# Altium schematic sheet BatteryCharger.SchDoc
size A4
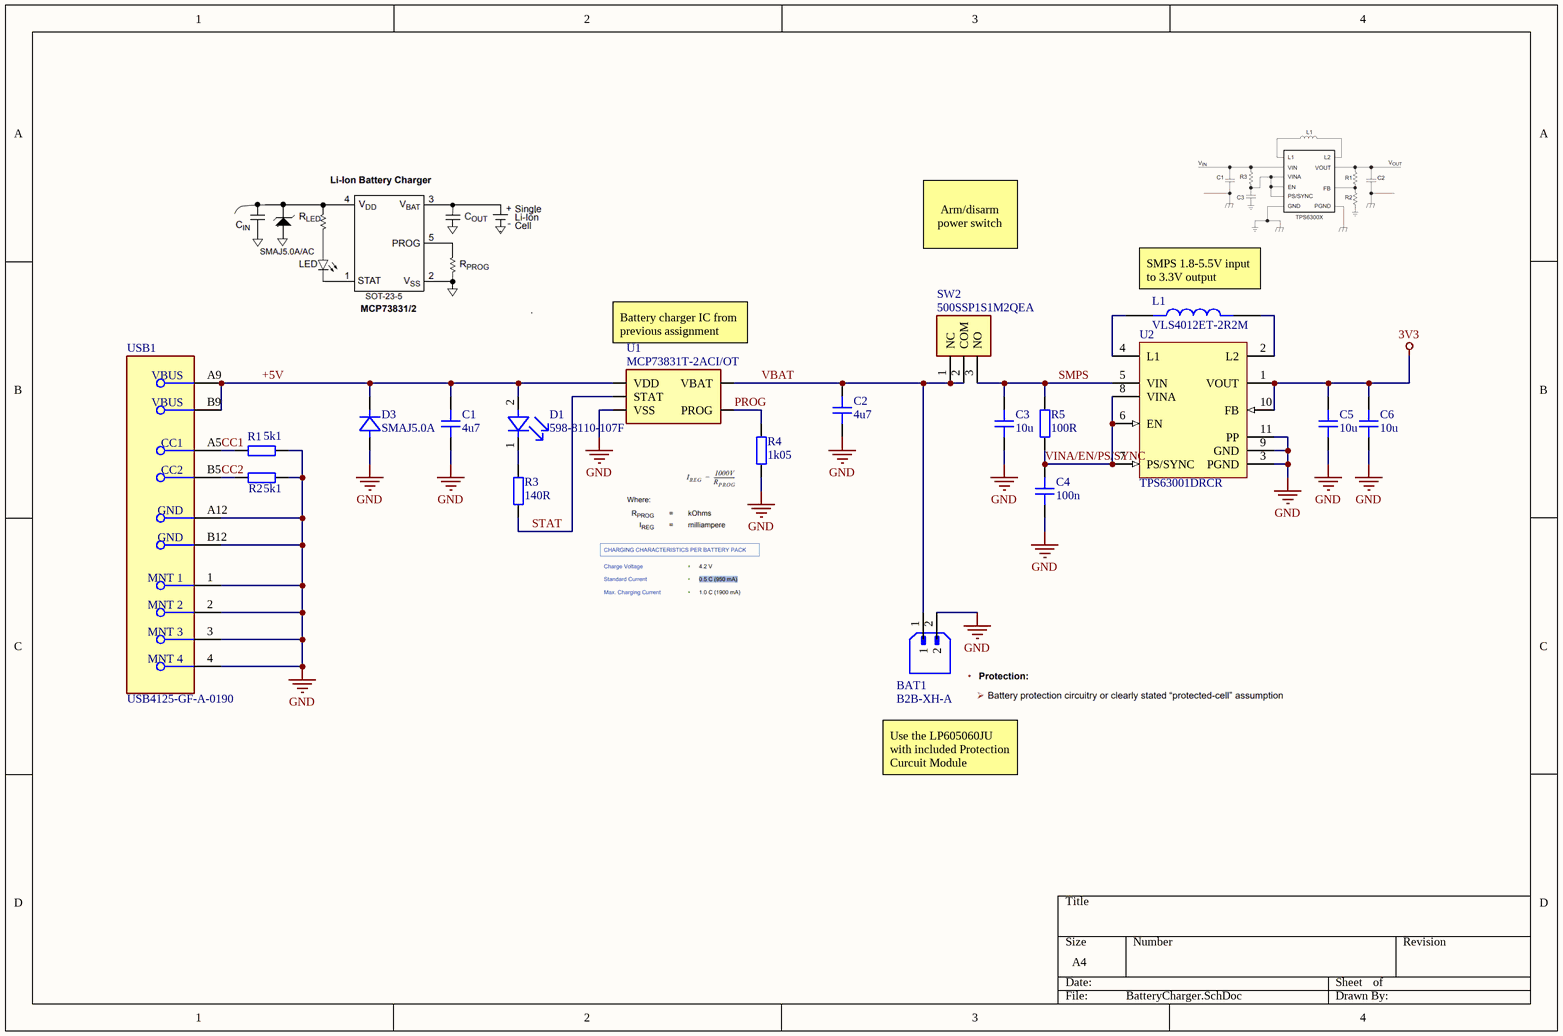
[diagram p0: BatteryCharger.SchDoc]

## Parts
BAT1  B2B-XH-A  [JST_B2B-XH-A]
C1  4u7  [CAP_0603]
C2  4u7  [CAP_0603]
C3  10u  [CAP_0603]
C4  100n  [CAP_0603]
C5  10u  [CAP_0603]
C6  10u  [CAP_0603]
D1  598-8110-107F  [RED_LED_0805]
D3  SMAJ5.0A  [SMASeries_LTF-M]
L1  VLS4012ET-2R2M  [IND_VLS4012ET-2R2M]
R1  5k1  [RES_0603]
R2  5k1  [RES_0603]
R3  140R  [RES_0603]
R4  1k05  [RES_0603]
R5  100R  [RES_0603]
SW2  500SSP1S1M2QEA  [500SSP1S1M2QEA]
U1  MCP73831T-2ACI/OT  [SOT95P270X145-5N]
U2  TPS63001DRCR  [DRC0010J_V]
USB1  USB4125-GF-A-0190  [FP-USB4125-GF-A-0190-MFG]

## Nets
3V3: C5.2 C6.2 U2.1(VOUT) U2.10(FB)
GND: BAT1.2 C1.1 C2.1 C3.1 C4.1 C5.1 C6.1 D3.2 R1.1 R2.2 R4.2 U1.2(VSS) U2.3(PGND) U2.9(GND) U2.11(PP) USB1.1(MNT_1) USB1.2(MNT_2) USB1.3(MNT_3) USB1.4(MNT_4) USB1.A12(GND) USB1.B12(GND)
+5V: C1.2 D1.2(A) D3.1 U1.4(VDD) USB1.A9(VBUS) USB1.B9(VBUS)
CC1: R1.2 USB1.A5(CC1)
CC2: R2.1 USB1.B5(CC2)
PROG: R4.1 U1.5(PROG)
SMPS: C3.2 R5.2 SW2.3(NO) U2.5(VIN)
STAT: R3.1 U1.1(STAT)
VBAT: BAT1.1 C2.2 SW2.1(NC) SW2.2(COM) U1.3(VBAT)
VINA/EN/PS/SYNC: C4.2 R5.1 U2.6(EN) U2.7(PS/SYNC) U2.8(VINA)
NetD1_1: D1.1(C) R3.2
NetL1_1: L1.1 U2.4(L1)
NetL1_2: L1.2 U2.2(L2)

## Notes on the sheet
- Arm/disarm power switch
- (near L1) SMPS 1.8-5.5V input to 3.3V output
- (near U1) Battery charger IC from previous assignment
- Use the LP605060JU with included Protection Curcuit Module

## Library data of the parts
BAT1 = B2B-XH-A: MF: {'manufacturer': u'JST Sales America Inc.'}; Package: None; Price: None; Value: *; MP: B2B-XH-A; Availability: Unavailable
C1-C6 = CAP_0603: Capacitor SMD 0603 / Ceramic; Manufacturer: *; Manufacturer Part Number: *; Distributor Link: *; LCSC: *; Rating: *; Dielectric: *
D1 = RED_LED_0805: 598-8110-107F 598-8110-107F, Dialight, SMD LED 0805 Package, Red Single color SOLD IN INCREMENTS OF 4000. (REEL); NexarPartId: 868569; Wavelength: 635nm; Forward Current: 20mA; Lens Style: Clear; Forward Voltage: 2.2V; Power Dissipation: 60mW; Max Junction Temperature (Tj): 105°C; Luminous Intensity: 40mcd; Viewing Angle: 140°; Reverse Voltage: 5V; Number of LEDs: 1; Number of Pins: 2; Schedule B: 8541402000, 8541402000|8541402000, 8541402000|8541402000|8541402000, 8541402000|8541402000|8541402000|8541402000; Length: 2mm; Width: 1.25mm; Mount: Surface Mount; Height: 800µm; Case Code (Imperial): 0805; Case Code (Metric): 2012; RoHS: Compliant; Min Operating Temperature: -30°C; Color: Red; Case/Package: 0805; Depth: 1.25mm; Lead Free: Lead Free; Max Operating Temperature: 85°C; Test Current: 20mA; Illumination Color: Red; Number of Elements: 1; Dominant Wavelength: 635nm; REACH SVHC: No SVHC; Radiation Hardening: No
D3 = SMAJ5.0A: ESD Protection Diode; Manufacturer_Name: Littelfuse Inc; Copyright: Copyright (C) 2025 Ultra Librarian. All rights reserved.; Manufacturer_Part_Number: SMAJ5.0A
L1 = VLS4012ET-2R2M: INDUCTOR, 2.2UH, 2.2A, 20%, SMD; Product Range:TDK - VLS-E Series; Inductance:2.2ÂµH; Inductance Tolerance:Â± 20%; Inductor Construction:Shielded; DC Resistance Max:0.081ohm; RMS Current (Irms):2.2A; Saturation Current (Isat):1.9A; Case Dimensions:4mm x 4mm x 1.2mm; SVHC:No SVHC (20-Jun-2013); MF: TDK; Package: NON STANDARD-2 TDK; SnapEDA_Link: https://www.snapeda.com/parts/VLS4012ET-2R2M/TDK/view-part/?ref=snap; Value: *; MP: VLS4012ET-2R2M; Purchase-URL: https://pricing.snapeda.com/search/part/VLS4012ET-2R2M/?ref=eda; Check_prices: https://www.snapeda.com/parts/VLS4012ET-2R2M/TDK/view-part/?ref=eda; Availability: In Stock; Price: None
R1-R5 = RES_0603: Resistor SMD 0603; Manufacturer: *; Manufacturer Part Number: *; Distributor Link: *; LCSC: *
SW2 = 500SSP1S1M2QEA: SLIDE, 5A, 120VAC/28VDC SPDT, On-On Through Hole; Manufacturer_Name: E-Switch; Geometry.Height: 11.43mm; Manufacturer_Part_Number: 500SSP1S1M2QEA; Mouser Part Number: 612-500-A121; Mouser Price/Stock: https://www.mouser.co.uk/ProductDetail/E-Switch/500SSP1S1M2QEA?qs=rR7wk9eDIwofjM3j2mZRnA%3D%3D; Arrow Part Number: *; Arrow Price/Stock: *; Datasheet Link: https://configured-product-images.s3.amazonaws.com/2D/specs/500SSP1S1M2QEA.pdf
U1 = MCP73831T-2ACI/OT: Li-Ion Charge Controller 4.2V SOT23-5; Manufacturer_Name: Microchip; Geometry.Height: 1.45mm; Mouser Part Number: 579-MCP73831T-2ACIOT; Mouser Price/Stock: https://www.mouser.co.uk/ProductDetail/Microchip-Technology/MCP73831T-2ACI-OT?qs=yUQqVecv4qvbBQBGbHx0Mw%3D%3D; Manufacturer_Part_Number: MCP73831T-2ACI/OT; Datasheet Link: http://ww1.microchip.com/downloads/en/DeviceDoc/20001984g.pdf
U2 = CMP-0345-00006-2: Buck-Boost Voltage Converter with 1.8 to 5.5 V Input and 3.3 V Output, -40 to 85 degC, 10-Pin SON (DRC), Green (RoHS & no Sb/Br); Manufacturer: Texas Instruments; Synchronous Rectification: TRUE; Iq(Typ)(mA): 0.03; Regulated Outputs(#): 1; Preset Vout(V): 3.3; Vin(Min)(V): 1.8; Switching Frequency(Max)(kHz): 1500; Iout(Max)(A): 1.2; SubFamily: Buck-Boost Regulator; Vin(Max)(V): 5.5; PartNumber: TPS63001DRCR; Topology: Buck-Boost; Dynamic Voltage Scaling: TRUE; PackageVersion: revL, Sep-2011; ComponentLink2Description: Package Specification; DatasheetVersion: SLVS520B; Eco-Plan: Green (RoHS & no Sb/Br); ComponentLink1URL: http://www.ti.com/general/docs/lit/getliterature.tsp?genericPartNumber=TPS63001&fileType=pdf; Mounting Technology: Surface Mount; Vout(Min)(V): 3.3; ComponentLink2URL: http://www.ti.com/litv/pdf/mpds117k; PackageDescription: 10-Pin Plastic Small Outline No-Lead, 3 x 3 x 1 mm Body, 0.5 mm Pitch, Exposed Pad; PackageReference: DRC0010J; Vout(Max)(V): 3.3; ComponentLink1Description: Datasheet
USB1 = USB type-C: CONN RCPT TYPE C 6P SMD RA